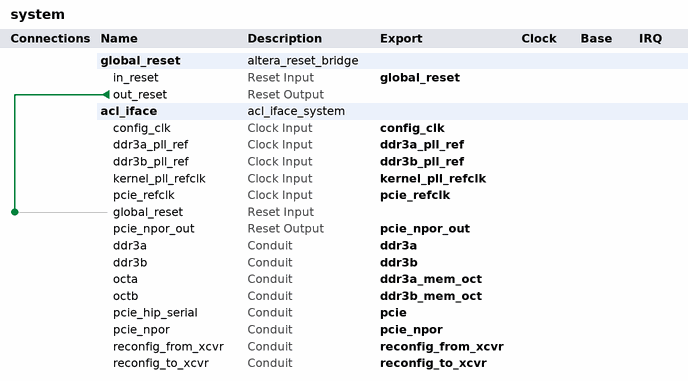
[diagram p0: system contents]
# Platform Designer (Qsys) system system, Stratix V Unknown
# Parameters at their usual value, and those the tool derives, are not listed.
package require -exact qsys 13.0
create_system system
set_project_property DEVICE_FAMILY {Stratix V}
set_project_property DEVICE Unknown

add_instance global_reset altera_reset_bridge 13.0
set_instance_parameter_value global_reset ACTIVE_LOW_RESET 1
set_instance_parameter_value global_reset SYNCHRONOUS_EDGES none

add_instance acl_iface acl_iface_system 1.0

# connections
add_connection global_reset.out_reset acl_iface.global_reset reset

# exported interfaces
add_interface ddr3a conduit end
set_interface_property ddr3a EXPORT_OF acl_iface.ddr3a
add_interface ddr3a_mem_oct conduit end
set_interface_property ddr3a_mem_oct EXPORT_OF acl_iface.octa
add_interface ddr3b_mem_oct conduit end
set_interface_property ddr3b_mem_oct EXPORT_OF acl_iface.octb
add_interface ddr3b_pll_ref clock sink
set_interface_property ddr3b_pll_ref EXPORT_OF acl_iface.ddr3b_pll_ref
add_interface pcie_refclk clock sink
set_interface_property pcie_refclk EXPORT_OF acl_iface.pcie_refclk
add_interface pcie conduit end
set_interface_property pcie EXPORT_OF acl_iface.pcie_hip_serial
add_interface pcie_npor conduit end
set_interface_property pcie_npor EXPORT_OF acl_iface.pcie_npor
add_interface ddr3a_pll_ref clock sink
set_interface_property ddr3a_pll_ref EXPORT_OF acl_iface.ddr3a_pll_ref
add_interface config_clk clock sink
set_interface_property config_clk EXPORT_OF acl_iface.config_clk
add_interface global_reset reset sink
set_interface_property global_reset EXPORT_OF global_reset.in_reset
add_interface ddr3b conduit end
set_interface_property ddr3b EXPORT_OF acl_iface.ddr3b
add_interface kernel_pll_refclk clock sink
set_interface_property kernel_pll_refclk EXPORT_OF acl_iface.kernel_pll_refclk
add_interface pcie_npor_out reset source
set_interface_property pcie_npor_out EXPORT_OF acl_iface.pcie_npor_out
add_interface reconfig_to_xcvr conduit end
set_interface_property reconfig_to_xcvr EXPORT_OF acl_iface.reconfig_to_xcvr
add_interface reconfig_from_xcvr conduit end
set_interface_property reconfig_from_xcvr EXPORT_OF acl_iface.reconfig_from_xcvr

set_interconnect_requirement {$system} qsys_mm.clockCrossingAdapter FIFO
set_interconnect_requirement {$system} qsys_mm.maxAdditionalLatency 0

save_system system.qsys
